# Altium schematic sheet Pwr_entry.SchDoc
size A4; Organization: Altium Limited; Address1: L3, 12a Rodborough Rd; Address2: Frenchs Forest; Address3: NSW; Address4: Australia 2086; SheetNumber: 4; SheetTotal: 6; SPICEModelCachePQHZHQPD: <root> / <DocumentId>PQHZHQPD</DocumentId> / <CacheFrame Number="0"> / <Model Name="1210_7447709470_47u" Kind="CKT"> / <Text>******* / .subckt 1210_7447709470_47u 1 2 / Rp 1 2 43179.7160489 / Cp 1 2 15.5579429534p / Rs 1 N3 0.0459 / L1 N3 2 38.0441176839u / .ends 1210_7447709470_47u</Text> / </Model> / </CacheFrame> / </root>
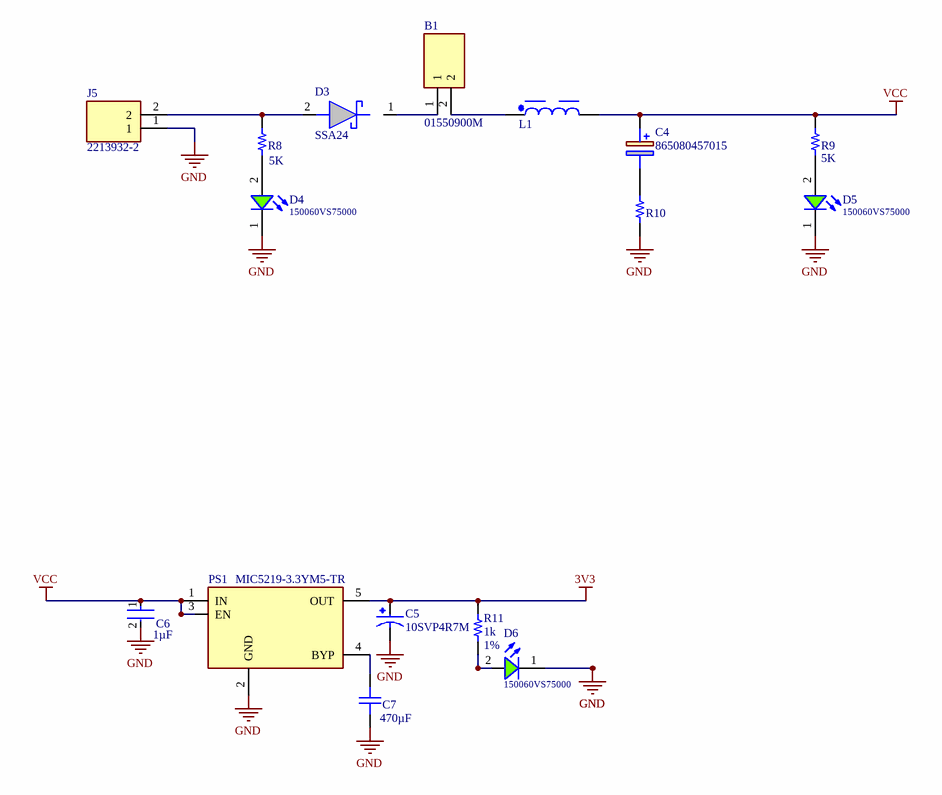
[diagram p0: Pwr_entry.SchDoc]

## Parts
B1  01550900M  [01550900M]
C4  865080457015  [CAPAE1030X1050L]
C5  10SVP4R7M  [CAP_10SVP4R7M]
C6  value 1µF  [FP-CL10-IPC_A]  (hidden comment: GCG188L8EE105KA07D)
C7  value 470µF  [FP-CL10-IPC_B]  (hidden comment: Capacitor)
D3  SSA24  [DIOM5227X250N]
D4  150060VS75000  [WL-SMCW_0603_H=0.7mm]
D5  150060VS75000  [WL-SMCW_0603_H=0.7mm]
D6  150060VS75000  [WL-SMCW_0603_H=0.7mm]
J5  2213932-2  [22139322]
L1  47uH, 3.8A  [WE-PD_1210]  (value not drawn)
PS1  MIC5219-3.3YM5-TR  [SOT95P280X145-5N]
R8  5K  [FP-CR0603-IPC_A]
R9  value 5K  [FP-CR0603-IPC_A]  (hidden comment: CR0603-JW-101ELF)
R10  CRCW08050000Z0EA  [RESC2013X50X30ML20T20]  (value not drawn)
R11  value 1k  Tolerance: 1%  [RESC1608X06N 0603 Medium Density]  (hidden comment: RC0603FR-071KL)

## Nets
3V3: C5.1 PS1.5(OUT) R11.2
GND: C5.2 C6.2 C7.1 D4.1(K) D5.1(K) D6.1(K) J5.1 PS1.2(GND) R10.1
VCC: C4.1(+) C6.1 L1.2 PS1.1(IN) PS1.3(EN) R9.2
NetB1_1: B1.1 D3.1(K)
NetB1_2: B1.2 L1.1
NetC4_2: C4.2(-) R10.2
NetC7_2: C7.2 PS1.4(BYP)
NetD3_2: D3.2(A) J5.2 R8.2
NetD4_2: D4.2(A) R8.1
NetD5_2: D5.2(A) R9.1
NetD6_2: D6.2(A) R11.1

## Notes on the sheet
- Title
- Size:
- Date:
- A4
- Designer:
- Time:
- Sheet
- Revision:
- of
- University of Stuttgart
- ILH
- Pfaffenwaldring 47
- 70569 Stuttgart
- Germany
- File:

## Library data of the parts
B1 = 01550900M: Fuse Block 10 A 125V 1 Circuit Cartridge Surface Mount; Manufacturer_Name: LITTELFUSE; Geometry.Height: 3.81mm; Mouser Part Number: 576-01550900M; Mouser Price/Stock: https://www.mouser.co.uk/ProductDetail/Littelfuse/01550900M?qs=DDoybve0rC%252BTXq1hqi5X1g%3D%3D; Manufacturer_Part_Number: 01550900M; Datasheet Link: http://www.littelfuse.com/~/media/electronics/datasheets/fuses/littelfuse_fuse_154_154t_154l_154tl_datasheet.pdf.pdf
C4 = 865080457015: Wurth Elektronik 470uF 25 V dc Aluminium Electrolytic Capacitor, WCAP-ASLI Series 2000h 10 (Dia.) x 10.35mm; Geometry.Height: 10.5mm; Mouser Part Number: 710-865080457015; Mouser Price/Stock: https://www.mouser.co.uk/ProductDetail/Wurth-Elektronik/865080457015?qs=0KOYDY2FL2%252BEKTJa1jxjAQ%3D%3D; Manufacturer_Name: Wurth Elektronik; Manufacturer_Part_Number: 865080457015; Datasheet Link: https://www.we-online.com/catalog/datasheet/865080457015_valid_from_2022-04-21.pdf
C6 = CMP-001-00050-1: Ceramic Capacitor, Multilayer, Ceramic, 16V, 10% +Tol, 10% -Tol, X8L, -40/+15% TC, 1uF, Surface Mount, 0603; Multilayer: Yes; Reference Standard: AEC-Q200; Mounting Technology: Surface Mount; Termination: Wraparound; Capacitor Type: Ceramic; Case/Package: 0603; Packaging: Tape and Reel; Max Operating Temperature: 150°C; Package Shape: Rectangular; Min Operating Temperature: -55°C; RoHS Compliant: Yes; Dielectric Material: Ceramic; Pins: 2; Temperature Characteristics Code: X8L; Tolerance  (fill in as +-): 10%; Rated DC Voltage (URdc): 16V; Tolerance (fill in as +-): 10%; Reach SVHC Compliant: Yes
C7 = CMP-024-000000-16: SMT Capacitor; Design Item ID: Capacitor; Source: Passives.SchLib
D3 = SSA24: Schottky Diodes & Rectifiers 2A, 40V SMA SCHOTTKY; Manufacturer_Name: onsemi; Geometry.Height: 2.5mm; Farnell Part Number: *; Farnell Price/Stock: *; Manufacturer_Part_Number: SSA24; Datasheet Link: https://www.onsemi.com/download/data-sheet/pdf/ssa24-d.pdf
D4-D6 = CMP-029-000010-2: WL-SMCW SMT Mono-color Chip LED Waterclear, size 0603, Bright Green, 2V, 140deg; Luminous Intensity typ.: 40mcd; Chip Technology: AlInGaP; Dominant Wavelength typ.: 570nm; Peak Wavelength typ.: 572nm; ComponentLink2Description: Datasheet; Published Date: December 2019; Part Number: 150060VS75000; Source: WL-SMCW_0603.SchLib; Size: 0603; ComponentLink1Description: Manufacturer; Emitting Color: Bright Green; Packaging: Tape and Reel; Operating Temperature: -40 to +85degC; ComponentLink1URL: http://www.we-online.de; Publisher: Wurth Elektronik; Design Item ID: 150060VS75000; Forward Voltage typ.: 2V; ComponentLink2URL: https://www.we-online.com/catalog/datasheet/150060VS75000.pdf; Mounting Technology: SMT; Viewing Angle: 140deg
J5 = 2213932-2: Body Features: Product Orientation Right Angle; Manufacturer_Name: TE Connectivity; Geometry.Height: 7mm; Mouser Part Number: 571-2213932-2; Mouser Price/Stock: https://www.mouser.co.uk/ProductDetail/TE-Connectivity-Buchanan/2213932-2?qs=BZBei1rCqCB1cq5VfQayMg%3D%3D; Manufacturer_Part_Number: 2213932-2; Datasheet Link: https://www.te.com/commerce/DocumentDelivery/DDEController?Action=srchrtrv&DocNm=1-1773930-3_BuchananWM_Brochure&DocType=Data%20Sheet&DocLang=English&PartCntxt=2213932-2&DocFormat=pdf
L1 = 7447709470: WE-PD SMT Power Inductor, size 1210, 47uH, 3.8A, 60mOhm; Manufacturer: Wurth Elektronik; Case/Size Code: 1210; DC Resistance: 46mOhm; Saturation Current: 4.5A; Self Resonant Frequency: 6.5MHz; Type: Standard; Manufacturer Part Number: 7447709470; Category: Power Inductors; Match Code: WE-PD; ComponentLink1Description: Website Link; ComponentLink1URL: https://www.we-online.com/redexpert/article/7447709470?ad; ComponentLink2Description: Datasheet Link; ComponentLink2URL: https://www.we-online.com/redexpert/spec/7447709470?ad; Mount: Surface Mount; Operating Temperature Max: 125°C; Operating Temperature Min: -40°C; Packaging: Tape and Reel; Length: 12mm; Width: 12mm; Height: 10mm; DC Resistance Max: 60mOhm; Inductance: 47uH; Rated Current: 3.8A
PS1 = MIC5219-3.3YM5-TR: LDO Regulator Pos 3.3V 0.5A Microchip MIC5219-3.3YM5-TR, LDO Voltage Regulator, 500mA, 3.3 V +/-2%, 2.5  12 Vin, 5-Pin SOT-23; Geometry.Height: 1.45mm; Mouser Part Number: 998-MIC5219-3.3YM5TR; Mouser Price/Stock: https://www.mouser.co.uk/ProductDetail/Microchip-Technology/MIC5219-3.3YM5-TR?qs=U6T8BxXiZAWojkIJMtSJlw%3D%3D; Manufacturer_Name: Microchip; Manufacturer_Part_Number: MIC5219-3.3YM5-TR; Datasheet Link: http://www.microchip.com/mymicrochip/filehandler.aspx?ddocname=en579712
R8 = CMP-009-00203-1: Fixed Resistor, Metal Glaze/thick Film, 0.1W, 100ohm, 75V, 5% +/-Tol, 200ppm/Cel, Surface Mount, 0603 CR0603-JW-101ELF; Power: 100mW; Tolerance: 5%; Min Operating Temperature: -55°C; Value: 5K; Max Operating Temperature: 155°C; Pins: 2; JLCPCB Part #: C913237; RoHS Compliant: Yes; Mounting Technology: Surface Mount; Case/Package: 0603
R9 = CMP-009-00203-1: Fixed Resistor, Metal Glaze/thick Film, 0.1W, 100ohm, 75V, 5% +/-Tol, 200ppm/Cel, Surface Mount, 0603; Power: 100mW; Tolerance: 5%; Min Operating Temperature: -55°C; Max Operating Temperature: 155°C; Pins: 2; JLCPCB Part #: C913237; RoHS Compliant: Yes; Mounting Technology: Surface Mount; Case/Package: 0603
R10 = CMP-009-00140-3: Fixed Resistor, Metal Glaze/thick Film, 0.125W, 0ohm, Surface Mount, 0805; Reference Standard: AEC-Q200; Package Length: 2mm; Power: 125mW; Package Width: 1.25mm; Rated Temperature: 70°C; Package Height: 0.45mm; Value: 0; Mounting Technology: Surface Mount; Resistor Type: FIXED RESISTOR; Packaging: Tape and Reel; Technology: METAL GLAZE/THICK FILM; RoHS Compliant: Yes; JESD-609 Code: e3; Min Operating Temperature: -55°C; Case/Package: 0805; Construction: Chip; Max Operating Temperature: 155°C; Terminal Finish: Nickel; Termination: Wraparound; Package Shape: Rectangular; Pins: 2; Reach SVHC Compliant: Yes; Package Style: SMTMeter
R11 = CMP-009-00006-14: RES SMD 1K OHM 1% 1/10W 0603; Temperature Coefficient: 100ppm/°C; Power: 100mW; Voltage Rating: 75V; JLCPCB Part #: C21190; Min Operating Temperature: -55°C; RoHS Compliant: Yes; Height: 0.45mm; Max Operating Temperature: 155°C; Depth: 0.8mm; Pins: 2; Case/Package: 0603; Length: 1.6mm; Mounting Technology: Surface Mount
C5 = 10SVP4R7M: MP: 10SVP4R7M; Availability: Unavailable; Package: None; Value: *; Price: None